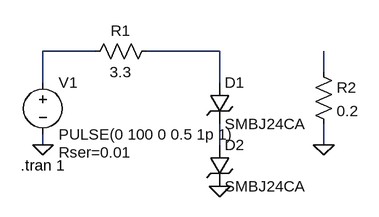
[diagram p0: schematic TVS.asc]
TVS.asc, the LTspice schematic file:
Version 4
SHEET 1 880 680
WIRE 16 80 -64 80
WIRE 208 80 96 80
WIRE 368 112 368 80
WIRE -64 128 -64 80
WIRE 208 128 208 80
WIRE -64 224 -64 208
WIRE 208 224 208 192
WIRE 368 224 368 192
FLAG -64 224 0
FLAG 368 224 0
FLAG 208 288 0
SYMBOL TVSdiode 192 128 R0
SYMATTR InstName D1
SYMATTR Value SMBJ24CA
SYMBOL res 0 96 R270
WINDOW 0 32 56 VTop 2
WINDOW 3 0 56 VBottom 2
SYMATTR InstName R1
SYMATTR Value 3.3
SYMATTR SpiceLine tol=1 pwr=3
SYMBOL voltage -64 112 R0
WINDOW 123 0 0 Left 2
WINDOW 39 24 124 Left 2
SYMATTR SpiceLine Rser=0.01
SYMATTR InstName V1
SYMATTR Value PULSE(0 100 0 0.5 1p 1)
SYMBOL res 352 96 R0
SYMATTR InstName R2
SYMATTR Value 0.2
SYMATTR SpiceLine tol=1 pwr=0.75
SYMBOL TVSdiode 192 224 R0
SYMATTR InstName D2
SYMATTR Value SMBJ24CA
TEXT -98 256 Left 2 !.tran 1

The netlist it stands for:
* TVS.asc
D1 N002 N004 SMBJ24CA
R1 N001 N002 3.3 tol=1 pwr=3
V1 N001 0 PULSE(0 100 0 0.5 1p 1) Rser=0.01
R2 N003 0 0.2 tol=1 pwr=0.75
D2 N004 0 SMBJ24CA
.model D D
.lib standard.dio
.tran 1
.backanno
.end